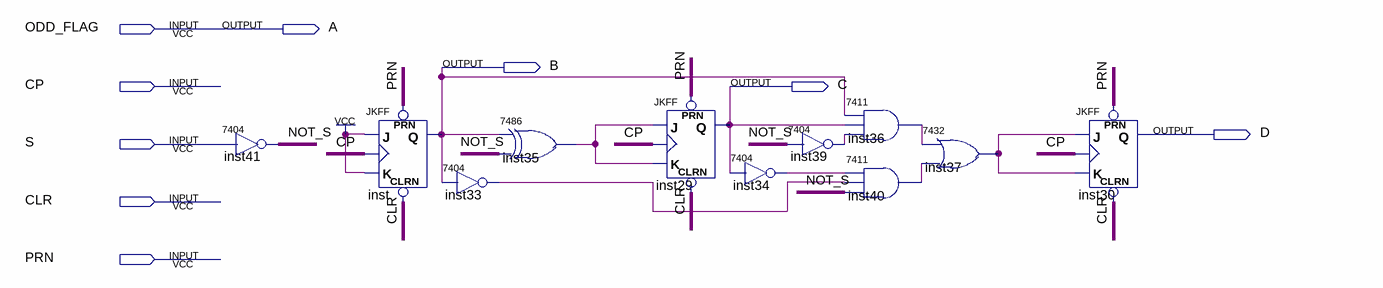
[diagram p0: schematic sheet]
// Quartus schematic Problem4.bdf as structural Verilog: 11 symbols, 9 pins
module Problem4 (
  input  ODD_FLAG,
  input  CP,
  input  S,
  input  CLR,
  input  PRN,
  output A,
  output B,
  output C,
  output D
);

  wire inst33_1, inst34_1, inst35_1, inst36_1, inst37_1, inst39_1, inst40_1, NOT_S;

  \7404  inst41 (.\2 (S), .\1 (NOT_S));
  JKFF inst (.PRN(PRN), .CLRN(CLR), .K(1'b1), .J(1'b1), .CLK(CP), .Q(B));
  \7404  inst33 (.\2 (B), .\1 (inst33_1));
  \7486  inst35 (.\2 (B), .\3 (NOT_S), .\1 (inst35_1));
  JKFF inst29 (.PRN(PRN), .CLRN(CLR), .K(inst35_1), .J(inst35_1), .CLK(CP), .Q(C));
  \7404  inst34 (.\2 (C), .\1 (inst34_1));
  \7404  inst39 (.\2 (NOT_S), .\1 (inst39_1));
  \7411  inst36 (.\2 (B), .\3 (C), .\4 (inst39_1), .\1 (inst36_1));
  \7411  inst40 (.\2 (inst34_1), .\3 (inst33_1), .\4 (NOT_S), .\1 (inst40_1));
  \7432  inst37 (.\2 (inst36_1), .\3 (inst40_1), .\1 (inst37_1));
  JKFF inst30 (.PRN(PRN), .CLRN(CLR), .K(inst37_1), .J(inst37_1), .CLK(CP), .Q(D));

  assign A = ODD_FLAG;
endmodule
